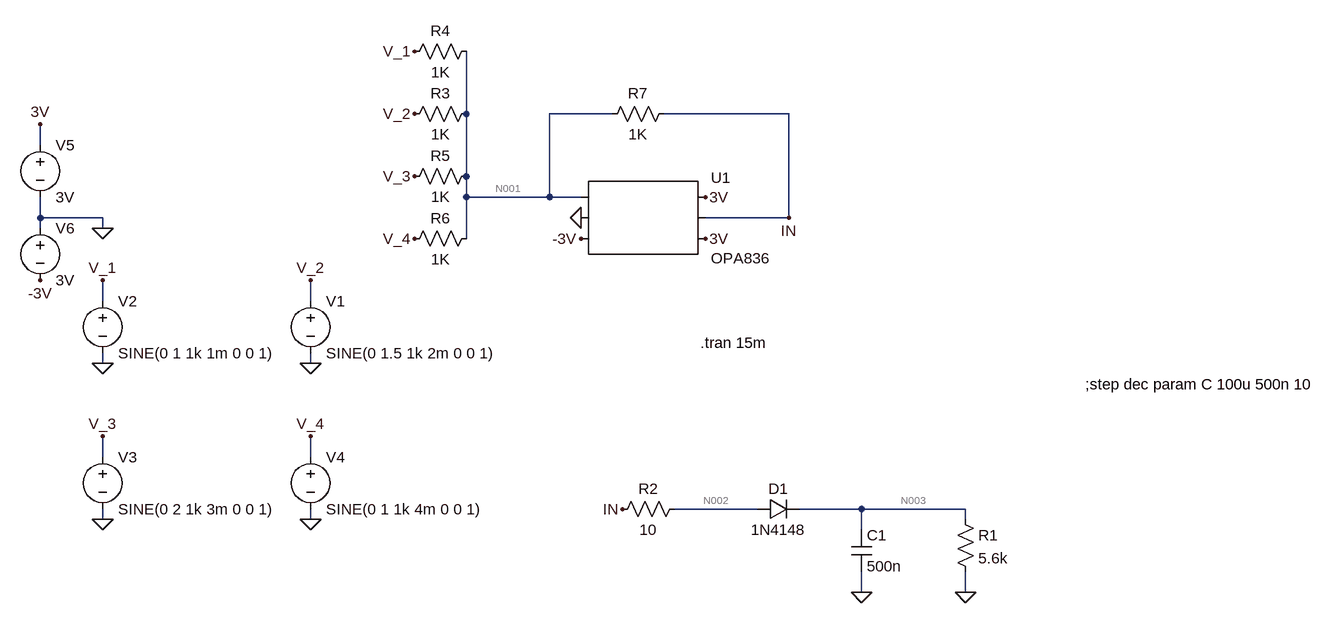
[diagram p0: schematic PK_adelson.asc]
* PK_adelson.asc
D1 N002 N003 1N4148
C1 N003 0 500n
R1 N003 0 5.6k
R2 N002 IN 10
V1 V_2 0 SINE(0 1.5 1k 2m 0 0 1)
V2 V_1 0 SINE(0 1 1k 1m 0 0 1)
V3 V_3 0 SINE(0 2 1k 3m 0 0 1)
V4 V_4 0 SINE(0 1 1k 4m 0 0 1)
* U1: OPA836 (symbol AutoGenerated\OPA836 not available, pins judged from their places): pin1=N001 pin2=0 pin3=-3V pin4=3V pin5=IN pin6=3V
V5 3V 0 3V
R3 N001 V_2 1K
R4 N001 V_1 1K
R5 N001 V_3 1K
R6 N001 V_4 1K
R7 IN N001 1K
V6 0 -3V 3V
.model D D
.lib standard.dio
.tran 15m
;step dec param C 100u 500n 10
.backanno
.end

* Results of the author's LTspice run, read from the files saved beside the schematic
* Operating Point, zero values left out:
*   V(n002) = 965.6 µV
*   V(n003) = 303.8 nV
*   V(in) = 965.6 µV
*   V(3v) = 3 V
*   V(-3v) = -3 V
*   V(n001) = 68.98 µV
*   I(D1) = 54.26 pA
*   I(R7) = 896.6 nA
*   I(R6) = 68.98 nA
*   I(R5) = 68.98 nA
*   I(R4) = 68.98 nA
*   I(R3) = 68.98 nA
*   I(R2) = -54.26 pA
*   I(R1) = 54.26 pA
*   I(V6) = -1.004 mA
*   I(V5) = -1.004 mA
*   I(V4) = 68.98 nA
*   I(V3) = 68.98 nA
*   I(V2) = 68.98 nA
*   I(V1) = 68.98 nA
*   Ix(u1:IN+) = 649.7 nA
*   Ix(u1:IN-) = 620.7 nA
*   Ix(u1:OUT) = -896.7 nA
*   Ix(u1:VCC) = 1.004 mA
*   Ix(u1:VEE) = -1.004 mA
*   Ix(u1:VNOT_PD) = 26 nA
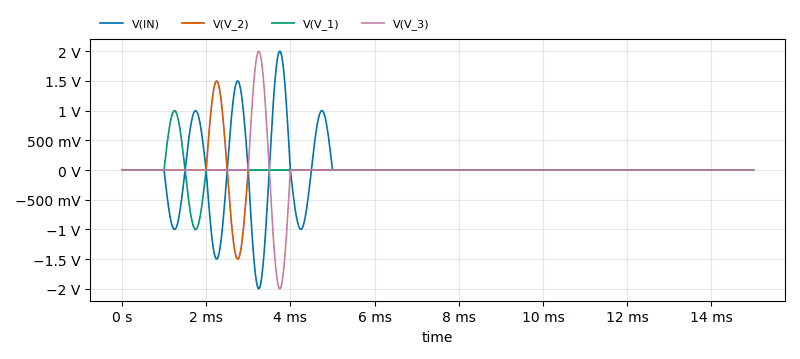
[diagram p1: Transient Analysis of PK_adelson.asc, plotted from the saved traces]
* Transient Analysis, 1 run:
*   V(IN): min -1.999 V, max 2.001 V, average 979.3 µV, rms 524.4 mV, last 966.3 µV
*   V(V_2): min -1.499 V, max 1.5 V, average -4.571 µV, rms 273.9 mV, last 0 V
*   V(V_1): min -999.9 mV, max 1 V, average -2.323 µV, rms 182.6 mV, last 0 V
*   V(V_3): min -2 V, max 2 V, average -6.921 µV, rms 365.2 mV, last 0 V